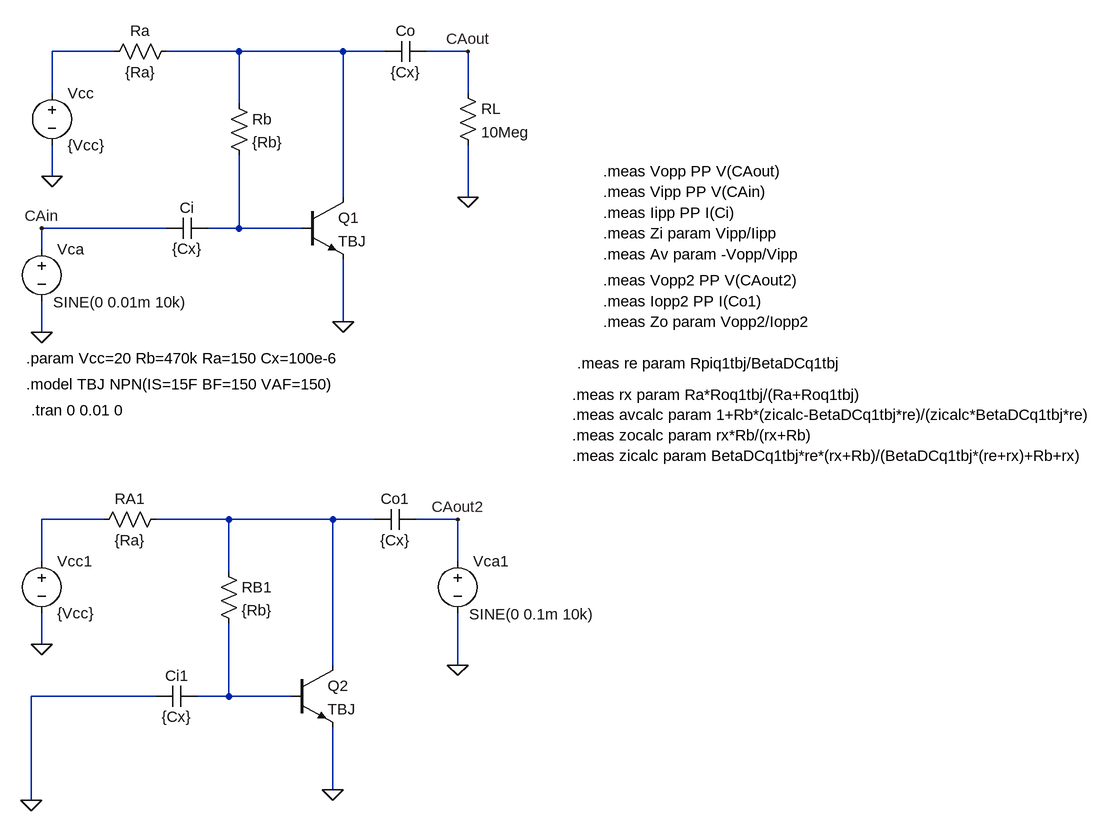
[diagram p0: schematic TBJ04CA.asc]
TBJ04CA.asc, the LTspice schematic file:
Version 4
SHEET 1 1952 1200
WIRE -64 -16 -160 -16
WIRE 128 -16 16 -16
WIRE 288 -16 128 -16
WIRE 352 -16 288 -16
WIRE 480 -16 416 -16
WIRE -160 48 -160 -16
WIRE 480 48 480 -16
WIRE 128 64 128 -16
WIRE -160 176 -160 128
WIRE 288 208 288 -16
WIRE 480 208 480 128
WIRE 16 256 -176 256
WIRE 128 256 128 144
WIRE 128 256 80 256
WIRE 224 256 128 256
WIRE -176 288 -176 256
WIRE 288 400 288 304
WIRE -176 416 -176 368
WIRE -80 704 -176 704
WIRE 112 704 0 704
WIRE 272 704 112 704
WIRE 336 704 272 704
WIRE 464 704 400 704
WIRE -176 768 -176 704
WIRE 464 768 464 704
WIRE 112 784 112 704
WIRE -176 896 -176 848
WIRE 272 928 272 704
WIRE 464 928 464 848
WIRE 0 976 -192 976
WIRE 112 976 112 864
WIRE 112 976 64 976
WIRE 208 976 112 976
WIRE 272 1120 272 1024
WIRE -192 1136 -192 976
FLAG -160 176 0
FLAG 288 400 0
FLAG -176 416 0
FLAG -176 256 CAin
FLAG 480 208 0
FLAG 480 -16 CAout
FLAG -176 896 0
FLAG 272 1120 0
FLAG -192 1136 0
FLAG 464 928 0
FLAG 464 704 CAout2
SYMBOL res 112 48 R0
SYMATTR InstName Rb
SYMATTR Value {Rb}
SYMBOL voltage -160 32 R0
WINDOW 123 0 0 Left 0
WINDOW 39 0 0 Left 0
SYMATTR InstName Vcc
SYMATTR Value {Vcc}
SYMBOL npn 224 208 R0
SYMATTR InstName Q1
SYMATTR Value TBJ
SYMBOL cap 80 240 R90
WINDOW 0 0 32 VBottom 2
WINDOW 3 32 32 VTop 2
SYMATTR InstName Ci
SYMATTR Value {Cx}
SYMBOL cap 416 -32 R90
WINDOW 0 0 32 VBottom 2
WINDOW 3 32 32 VTop 2
SYMATTR InstName Co
SYMATTR Value {Cx}
SYMBOL voltage -176 272 R0
WINDOW 123 0 0 Left 0
WINDOW 39 0 0 Left 0
WINDOW 3 18 98 Left 2
SYMATTR Value SINE(0 0.01m 10k)
SYMATTR InstName Vca
SYMBOL res 464 32 R0
SYMATTR InstName RL
SYMATTR Value 10Meg
SYMBOL res 32 -32 R90
WINDOW 0 0 56 VBottom 2
WINDOW 3 32 56 VTop 2
SYMATTR InstName Ra
SYMATTR Value {Ra}
SYMBOL res 96 768 R0
SYMATTR InstName RB1
SYMATTR Value {Rb}
SYMBOL voltage -176 752 R0
WINDOW 123 0 0 Left 0
WINDOW 39 0 0 Left 0
SYMATTR InstName Vcc1
SYMATTR Value {Vcc}
SYMBOL npn 208 928 R0
SYMATTR InstName Q2
SYMATTR Value TBJ
SYMBOL cap 64 960 R90
WINDOW 0 0 32 VBottom 2
WINDOW 3 32 32 VTop 2
SYMATTR InstName Ci1
SYMATTR Value {Cx}
SYMBOL cap 400 688 R90
WINDOW 0 0 32 VBottom 2
WINDOW 3 32 32 VTop 2
SYMATTR InstName Co1
SYMATTR Value {Cx}
SYMBOL voltage 464 752 R0
WINDOW 123 0 0 Left 0
WINDOW 39 0 0 Left 0
WINDOW 3 18 98 Left 2
SYMATTR Value SINE(0 0.1m 10k)
SYMATTR InstName Vca1
SYMBOL res 16 688 R90
WINDOW 0 0 56 VBottom 2
WINDOW 3 32 56 VTop 2
SYMATTR InstName RA1
SYMATTR Value {Ra}
TEXT -192 536 Left 2 !.tran 0 0.01 0
TEXT -200 456 Left 2 !.param Vcc=20 Rb=470k Ra=150 Cx=100e-6
TEXT -200 496 Left 2 !.model TBJ NPN(IS=15F BF=150 VAF=150)
TEXT 688 200 Left 2 !.meas Vipp PP V(CAin)
TEXT 688 232 Left 2 !.meas Iipp PP I(Ci)
TEXT 688 264 Left 2 !.meas Zi param Vipp/Iipp
TEXT 688 168 Left 2 !.meas Vopp PP V(CAout)
TEXT 688 296 Left 2 !.meas Av param -Vopp/Vipp
TEXT 688 336 Left 2 !.meas Vopp2 PP V(CAout2)
TEXT 688 368 Left 2 !.meas Iopp2 PP I(Co1)
TEXT 688 400 Left 2 !.meas Zo param Vopp2/Iopp2
TEXT 648 464 Left 2 !.meas re param Rpiq1tbj/BetaDCq1tbj
TEXT 640 512 Left 2 !.meas rx param Ra*Roq1tbj/(Ra+Roq1tbj)\n.meas avcalc param 1+Rb*(zicalc-BetaDCq1tbj*re)/(zicalc*BetaDCq1tbj*re)\n.meas zocalc param rx*Rb/(rx+Rb)\n.meas zicalc param BetaDCq1tbj*re*(rx+Rb)/(BetaDCq1tbj*(re+rx)+Rb+rx)

The netlist it stands for:
* TBJ04CA.asc
Rb N002 N003 {Rb}
Vcc N001 0 {Vcc}
Q1 N002 N003 0 0 TBJ
Ci N003 CAin {Cx}
Co CAout N002 {Cx}
Vca CAin 0 SINE(0 0.01m 10k)
RL CAout 0 10Meg
Ra N002 N001 {Ra}
RB1 N005 N006 {Rb}
Vcc1 N004 0 {Vcc}
Q2 N005 N006 0 0 TBJ
Ci1 N006 0 {Cx}
Co1 CAout2 N005 {Cx}
Vca1 CAout2 0 SINE(0 0.1m 10k)
RA1 N005 N004 {Ra}
.model NPN NPN
.model PNP PNP
.lib standard.bjt
.tran 0 0.01 0
.param Vcc=20 Rb=470k Ra=150 Cx=100e-6
.model TBJ NPN(IS=15F BF=150 VAF=150)
.meas Vipp PP V(CAin)
.meas Iipp PP I(Ci)
.meas Zi param Vipp/Iipp
.meas Vopp PP V(CAout)
.meas Av param -Vopp/Vipp
.meas Vopp2 PP V(CAout2)
.meas Iopp2 PP I(Co1)
.meas Zo param Vopp2/Iopp2
.meas re param Rpiq1tbj/BetaDCq1tbj
.meas rx param Ra*Roq1tbj/(Ra+Roq1tbj)
.meas avcalc param 1+Rb*(zicalc-BetaDCq1tbj*re)/(zicalc*BetaDCq1tbj*re)
.meas zocalc param rx*Rb/(rx+Rb)
.meas zicalc param BetaDCq1tbj*re*(rx+Rb)/(BetaDCq1tbj*(re+rx)+Rb+rx)
.backanno
.end